# EAGLE design RF_INPUT_DIFF (EAGLE 7.4.0)
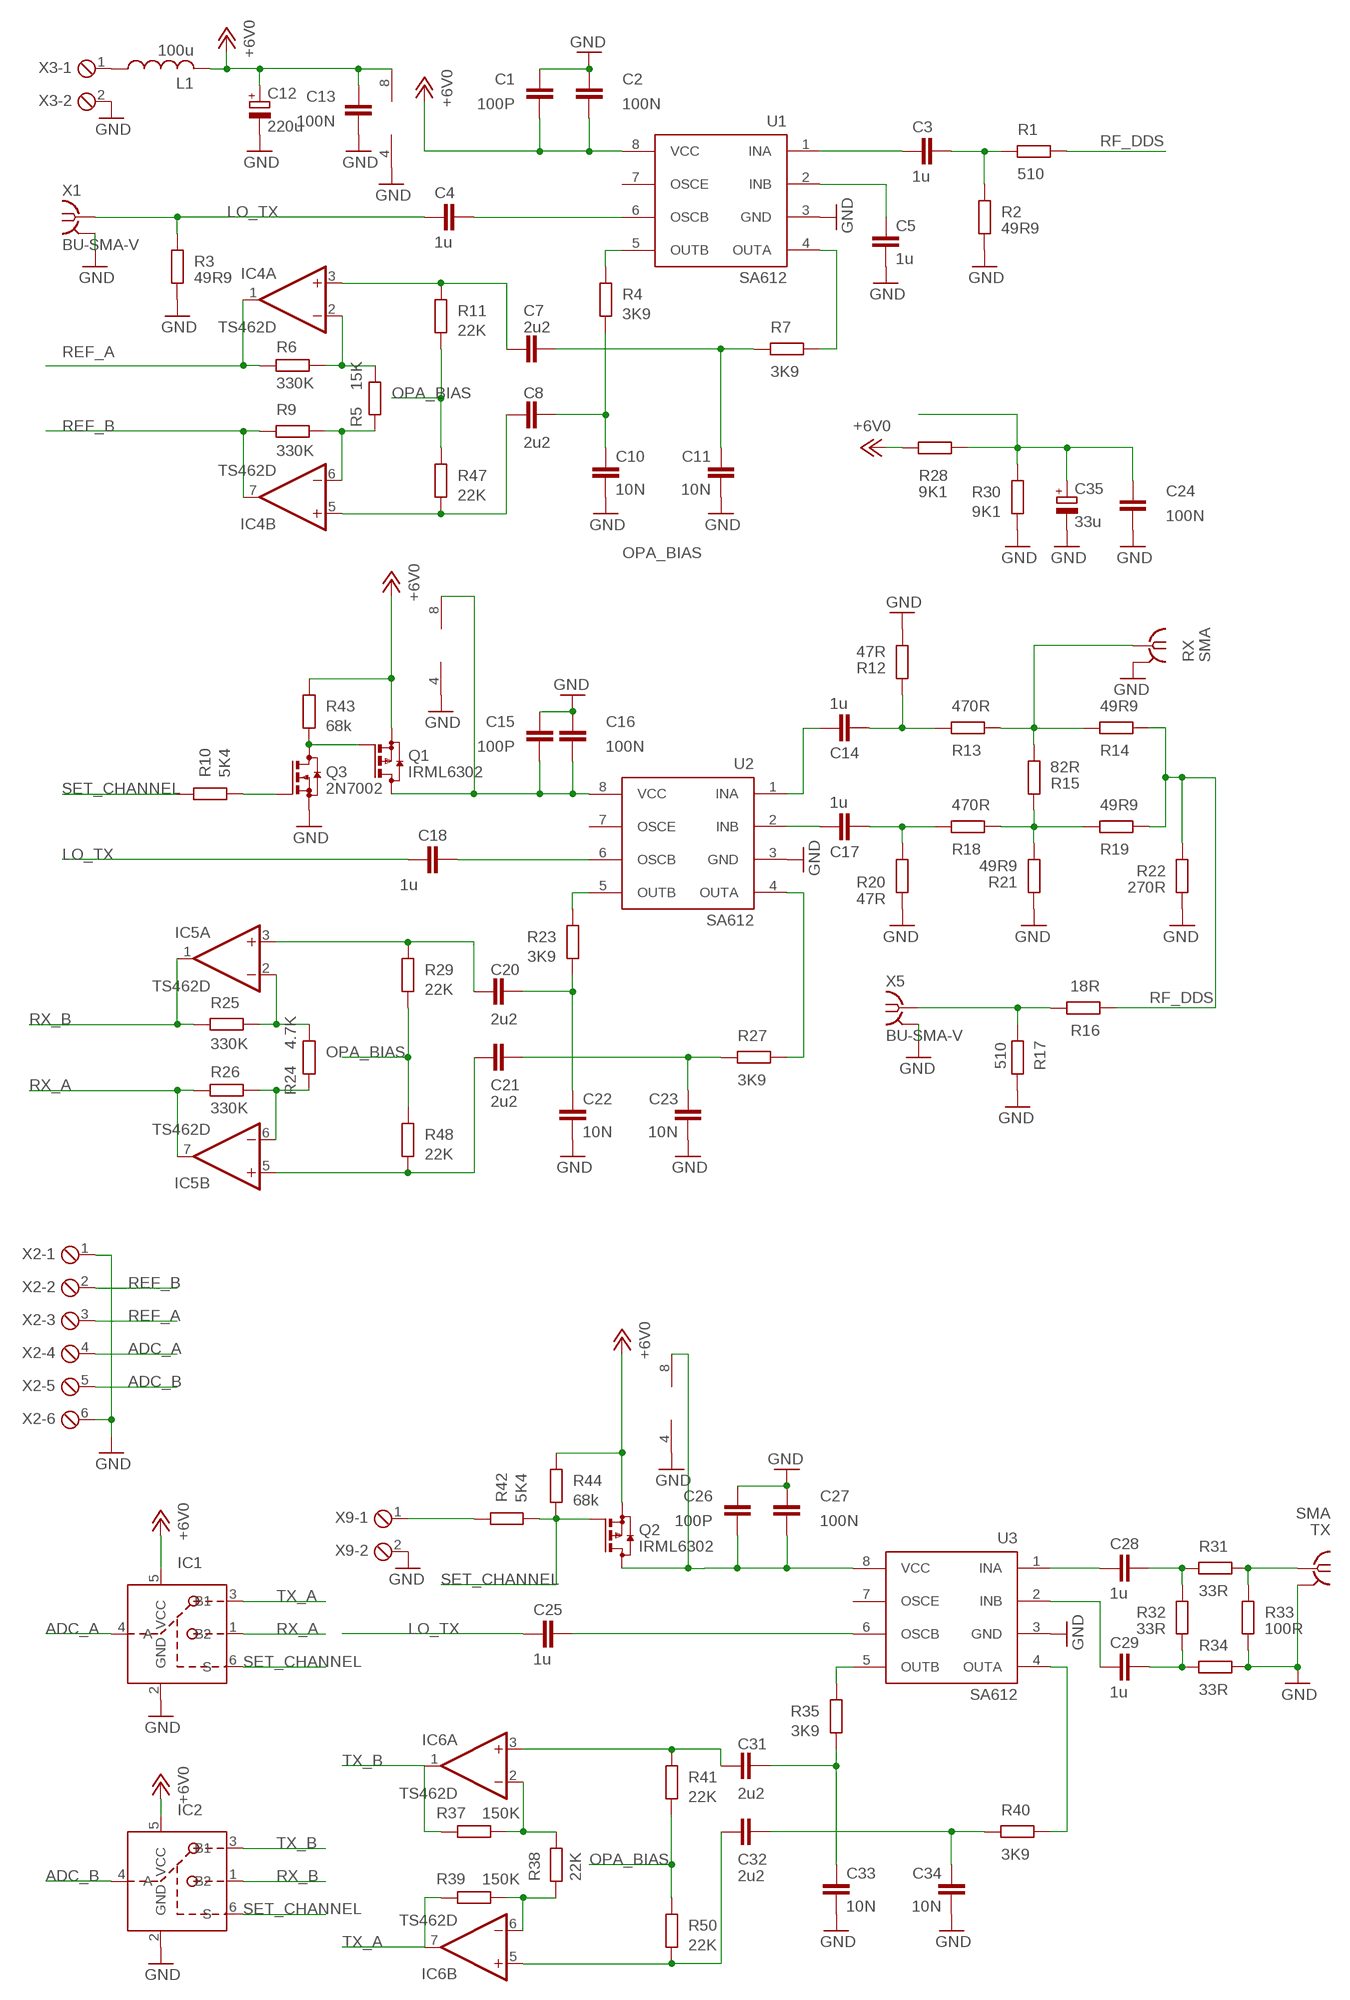
[diagram p0: schematic, sheet 1]

## Parts
C1  100P  C-EUC0805  [C0805]
C2  100N  C-EUC0603  [C0603]
C3  1u  C-EUC0603  [C0603]
C4  1u  C-EUC0805  [C0805]
C5  1u  C-EUC0603  [C0603]
C7  2u2  C-EUC0805  [C0805]
C8  2u2  C-EUC0805  [C0805]
C10  10N  C-EUC0805  [C0805]
C11  10N  C-EUC0805  [C0805]
C12  220u  CPOL-EU153CLV-0605  [153CLV-0605]
C13  100N  C-EUC0603  [C0603]
C14  1u  C-EUC0603  [C0603]
C15  100P  C-EUC0805  [C0805]
C16  100N  C-EUC0603  [C0603]
C17  1u  C-EUC0603  [C0603]
C18  1u  C-EUC0805  [C0805]
C20  2u2  C-EUC0805  [C0805]
C21  2u2  C-EUC0805  [C0805]
C22  10N  C-EUC0805  [C0805]
C23  10N  C-EUC0805  [C0805]
C24  100N  C-EUC0603  [C0603]
C25  1u  C-EUC0805  [C0805]
C26  100P  C-EUC0805  [C0805]
C27  100N  C-EUC0603  [C0603]
C28  1u  C-EUC0603  [C0603]
C29  1u  C-EUC0603  [C0603]
C31  2u2  C-EUC0805  [C0805]
C32  2u2  C-EUC0805  [C0805]
C33  10N  C-EUC0805  [C0805]
C34  10N  C-EUC0805  [C0805]
C35  33u  CPOL-EU153CLV-0605  [153CLV-0605]
IC1  SN74LVC1G3157DBVR  [SOT23-6]
IC2  SN74LVC1G3157DBVR  [SOT23-6]
IC4  TS462D  LM358D  [SO08]
IC5  TS462D  LM358D  [SO08]
IC6  TS462D  LM358D  [SO08]
L1  100u  L-US0207/12  [0207/12]
Q1  IRML6302  BSS84  [SOT23]
Q2  IRML6302  BSS84  [SOT23]
Q3  2N7002  BSS123  [SOT23]
R1  510  R-EU_R0603  [R0603]
R2  49R9  R-EU_R0805  [R0805]
R3  49R9  R-EU_R0805  [R0805]
R4  3K9  R-EU_R0603  [R0603]
R5  15K  R-EU_R0603  [R0603]
R6  330K  R-EU_R0603  [R0603]
R7  3K9  R-EU_R0603  [R0603]
R9  330K  R-EU_R0603  [R0603]
R10  5K4  R-EU_R0603  [R0603]
R11  22K  R-EU_R0603  [R0603]
R12  47R  R-EU_R0603  [R0603]
R13  470R  R-EU_R0603  [R0603]
R14  49R9  R-EU_R0805  [R0805]
R15  82R  R-EU_R0603  [R0603]
R16  18R  R-EU_R0603  [R0603]
R17  510  R-EU_R0603  [R0603]
R18  470R  R-EU_R0603  [R0603]
R19  49R9  R-EU_R0805  [R0805]
R20  47R  R-EU_R0603  [R0603]
R21  49R9  R-EU_R0805  [R0805]
R22  270R  R-EU_R0603  [R0603]
R23  3K9  R-EU_R0603  [R0603]
R24  4.7K  R-EU_R0603  [R0603]
R25  330K  R-EU_R0603  [R0603]
R26  330K  R-EU_R0603  [R0603]
R27  3K9  R-EU_R0603  [R0603]
R28  9K1  R-EU_R0603  [R0603]
R29  22K  R-EU_R0603  [R0603]
R30  9K1  R-EU_R0603  [R0603]
R31  33R  R-EU_R0603  [R0603]
R32  33R  R-EU_R0603  [R0603]
R33  100R  R-EU_R0603  [R0603]
R34  33R  R-EU_R0603  [R0603]
R35  3K9  R-EU_R0603  [R0603]
R37  150K  R-EU_R0603  [R0603]
R38  22K  R-EU_R0603  [R0603]
R39  150K  R-EU_R0603  [R0603]
R40  3K9  R-EU_R0603  [R0603]
R41  22K  R-EU_R0603  [R0603]
R42  5K4  R-EU_R0603  [R0603]
R43  68k  R-EU_R0603  [R0603]
R44  68k  R-EU_R0603  [R0603]
R47  22K  R-EU_R0603  [R0603]
R48  22K  R-EU_R0603  [R0603]
R50  22K  R-EU_R0603  [R0603]
RX  SMA  SMA-142-0701-801/806  [J502-ND-142-0701-801/806]
TX  SMA  SMA-142-0701-801/806  [J502-ND-142-0701-801/806]
U1  SA612  [SO8]
U2  SA612  [SO8]
U3  SA612  [SO8]
X1  BU-SMA-V  [BU-SMA-V]
X2  MPT6  [6POL254]
X3  MPT2  [2POL254]
X5  BU-SMA-V  [BU-SMA-V]
X9  MPT2  [2POL254]

## Nets
+6V0: C1.1 C2.1 C12.+ C13.1 IC1.5(VCC) IC2.5(VCC) IC4.8(P:V+) L1.2 Q1.2(S) Q2.2(S) R28.2 R43.1 R44.1 U1.8(VCC)
ADC_A: IC1.4(A) X2.4
ADC_B: IC2.4(A) X2.5
GND: C1.2 C2.2 C5.2 C10.2 C11.2 C12.- C13.2 C15.2 C16.2 C22.2 C23.2 C24.1 C26.2 C27.2 C33.2 C34.2 C35.- IC1.2(GND) IC2.2(GND) IC4.4(P:V-) IC5.4(P:V-) IC6.4(P:V-) Q3.2(S) R2.1 R3.2 R12.2 R17.2 R20.1 R21.1 R22.2 R30.2 R33.2 R34.1 RX.G@1 RX.G@2 RX.G@3 RX.G@4 TX.G@1 TX.G@2 TX.G@3 TX.G@4 U1.3(GND) U2.3(GND) U3.3(GND) X1.2 X1.3 X1.4 X1.5 X2.1 X2.6 X3.2 X5.2 X5.3 X5.4 X5.5 X9.2
LO_TX: C4.1 C18.1 C25.1 R3.1 X1.1
N$1: R15.1 R18.1 R19.2 R21.2
N$2: IC6.2(A:-IN) R37.1 R38.1
N$3: C25.2 U3.6(OSCB)
N$4: C26.1 C27.1 IC6.8(P:V+) Q2.3(D) U3.8(VCC)
N$5: R13.1 R14.2 R15.2 RX.1
N$6: Q1.1(G) Q3.3(D) R43.2
N$7: L1.1 X3.1
N$8: C15.1 C16.1 IC5.8(P:V+) Q1.3(D) U2.8(VCC)
N$9: R42.1 X9.1
N$10: IC4.2(A:-IN) R5.1 R6.1
N$11: C31.1 IC6.3(A:+IN) R41.1
N$12: C32.1 IC6.5(B:+IN) R50.2
N$13: IC4.6(B:-IN) R5.2 R9.1
N$14: Q3.1(G) R10.2
N$17: C7.1 IC4.3(A:+IN) R11.1
N$18: C8.1 IC4.5(B:+IN) R47.2
N$19: C20.1 IC5.3(A:+IN) R29.1
N$20: C21.1 IC5.5(B:+IN) R48.2
N$21: IC5.6(B:-IN) R24.2 R26.1
N$22: IC5.2(A:-IN) R24.1 R25.1
N$26: IC6.6(B:-IN) R38.2 R39.1
N$30: R31.1 R33.1 TX.1
N$31: C28.2 R31.2 R32.1
N$32: C29.2 R32.2 R34.2
N$33: C29.1 U3.2(INB)
N$34: C28.1 U3.1(INA)
N$35: C31.2 C33.1 R35.2
N$36: R40.1 U3.4(OUTA)
N$37: C32.2 C34.1 R40.2
N$38: R35.1 U3.5(OUTB)
N$39: C17.1 U2.2(INB)
N$42: C17.2 R18.2 R20.2
N$49: C14.1 U2.1(INA)
N$51: C20.2 C22.1 R23.2
N$52: R27.1 U2.4(OUTA)
N$53: C21.2 C23.1 R27.2
N$54: R23.1 U2.5(OUTB)
N$60: C14.2 R12.1 R13.2
N$61: C18.2 U2.6(OSCB)
N$62: C5.1 U1.2(INB)
N$63: R14.1 R16.2 R19.1 R22.1
N$64: C3.1 U1.1(INA)
N$65: C8.2 C10.1 R4.2
N$66: R7.1 U1.4(OUTA)
N$67: C7.2 C11.1 R7.2
N$68: R4.1 U1.5(OUTB)
N$74: C3.2 R1.2 R2.2
N$76: C4.2 U1.6(OSCB)
OPA_BIAS: C24.2 C35.+ R11.2 R28.1 R29.2 R30.1 R41.2 R47.1 R48.1 R50.1
REF_A: IC4.1(A:OUT) R6.2 X2.3
REF_B: IC4.7(B:OUT) R9.2 X2.2
RF_DDS: R1.1 R16.1 R17.1 X5.1
RX_A: IC1.1(B2) IC5.7(B:OUT) R26.2
RX_B: IC2.1(B2) IC5.1(A:OUT) R25.2
SET_CHANNEL: IC1.6(S) IC2.6(S) Q2.1(G) R10.1 R42.2 R44.2
TX_A: IC1.3(B1) IC6.7(B:OUT) R39.2
TX_B: IC2.3(B1) IC6.1(A:OUT) R37.2
Unconnected: U1.7(OSCE) U2.7(OSCE) U3.7(OSCE)

## Library data of the parts
C1-C5 C7 C8 C10 C11 C13-C18 C20-C29 C31-C34 = rcl:C-EU: CAPACITOR, European symbol
C12 C35 = rcl:CPOL-EU: POLARIZED CAPACITOR, European symbol
IC1 IC2 = balmer:SN74LVC1G3157DBVR: SINGLE-POLE DOUBLE-THROW ANALOG SWITCH
IC4-IC6 = linear:LM358: OP AMP also LM158; LM258; LM2904 Source: http://cache.national.com/ds/LM/LM158.pdf
L1 = rcl:L-US: INDUCTOR, American symbol
Q1 Q2 = transistor-small-signal:BSS84: P-CHANNEL MOS FET
Q3 = transistor-small-signal:BSS123: N-CHANNEL MOS FET
R1-R7 R9-R35 R37-R44 R47 R48 R50 = rcl:R-EU_: RESISTOR, European symbol
RX TX = con-coax:SMA-: SMA 50 Ohm End Launch Jack Receptacle - Round Contact Johnson Components Source: www.johnsoncomponents.com .. J502-ND.pdf; MF: JOHNSON COMPONENTS; MPN: 142-0701-801; OC_FARNELL: 1608592; OC_NEWARK: 90F2624
U1-U3 = vnwa:SA612
X1 X5 = con-coax:BU-SMA-V: FEMALE SMA CONNECTOR Radiall distributor RS 112-3794; OC_FARNELL: unknown; OC_NEWARK: unknown
X2 = con-phoenix-254:MPT6: PHOENIX CONNECTOR; OC_FARNELL: unknown; OC_NEWARK: unknown
X3 X9 = con-phoenix-254:MPT2: PHOENIX CONNECTOR; OC_FARNELL: unknown; OC_NEWARK: unknown

## Board
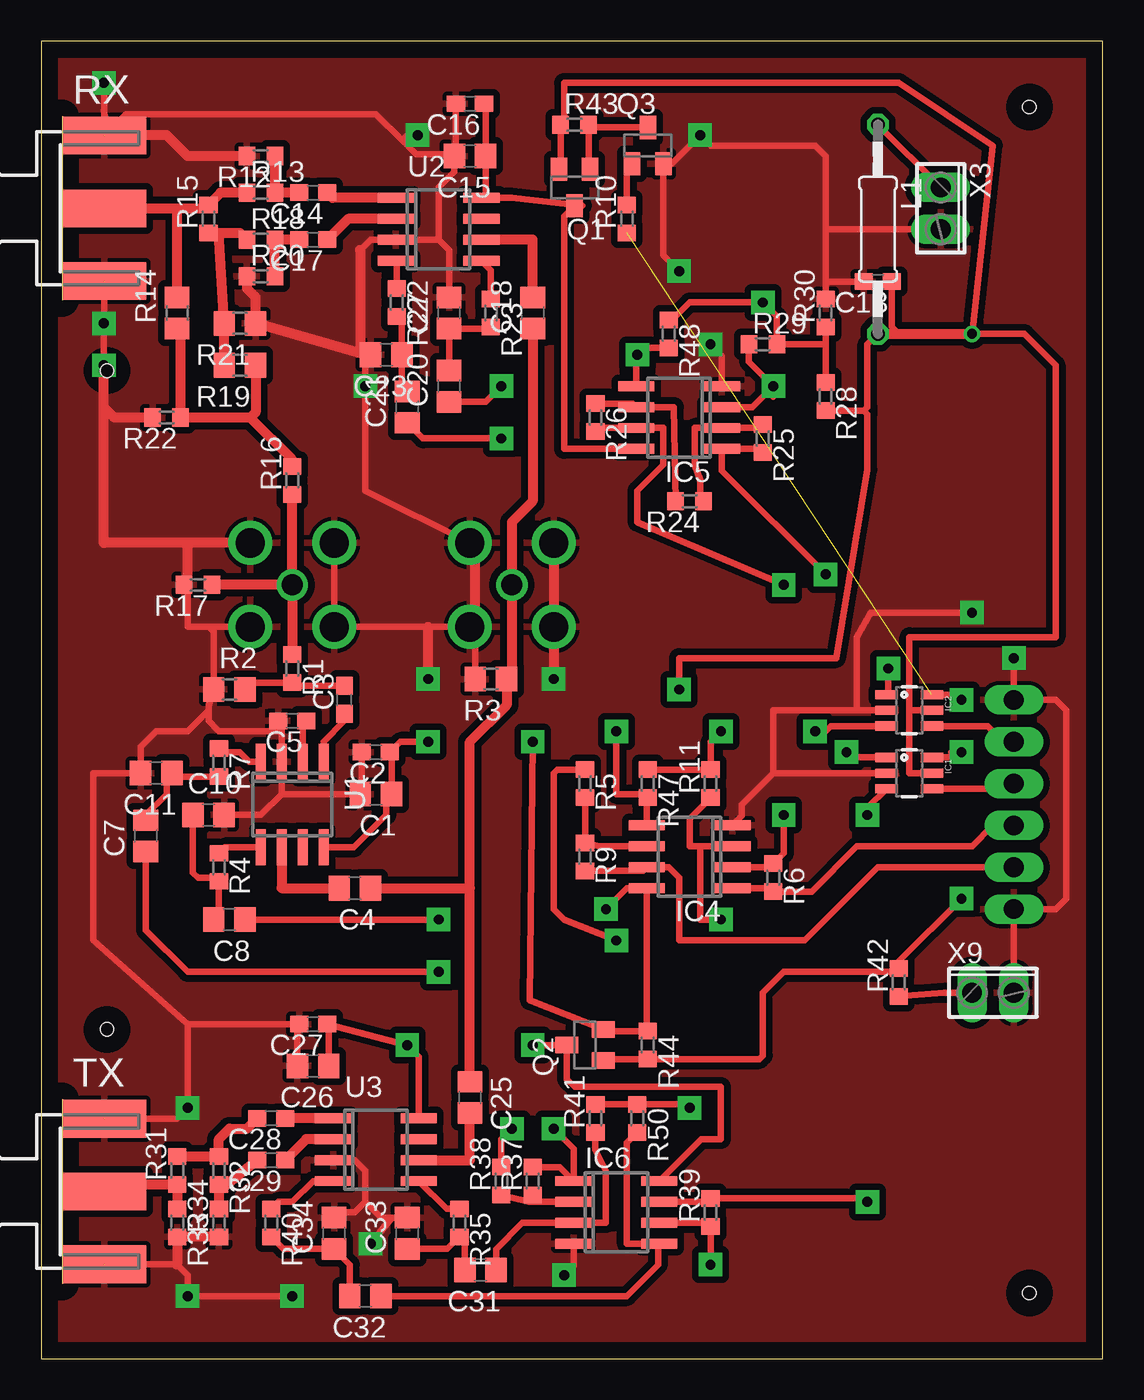
[diagram p1: board, top side]
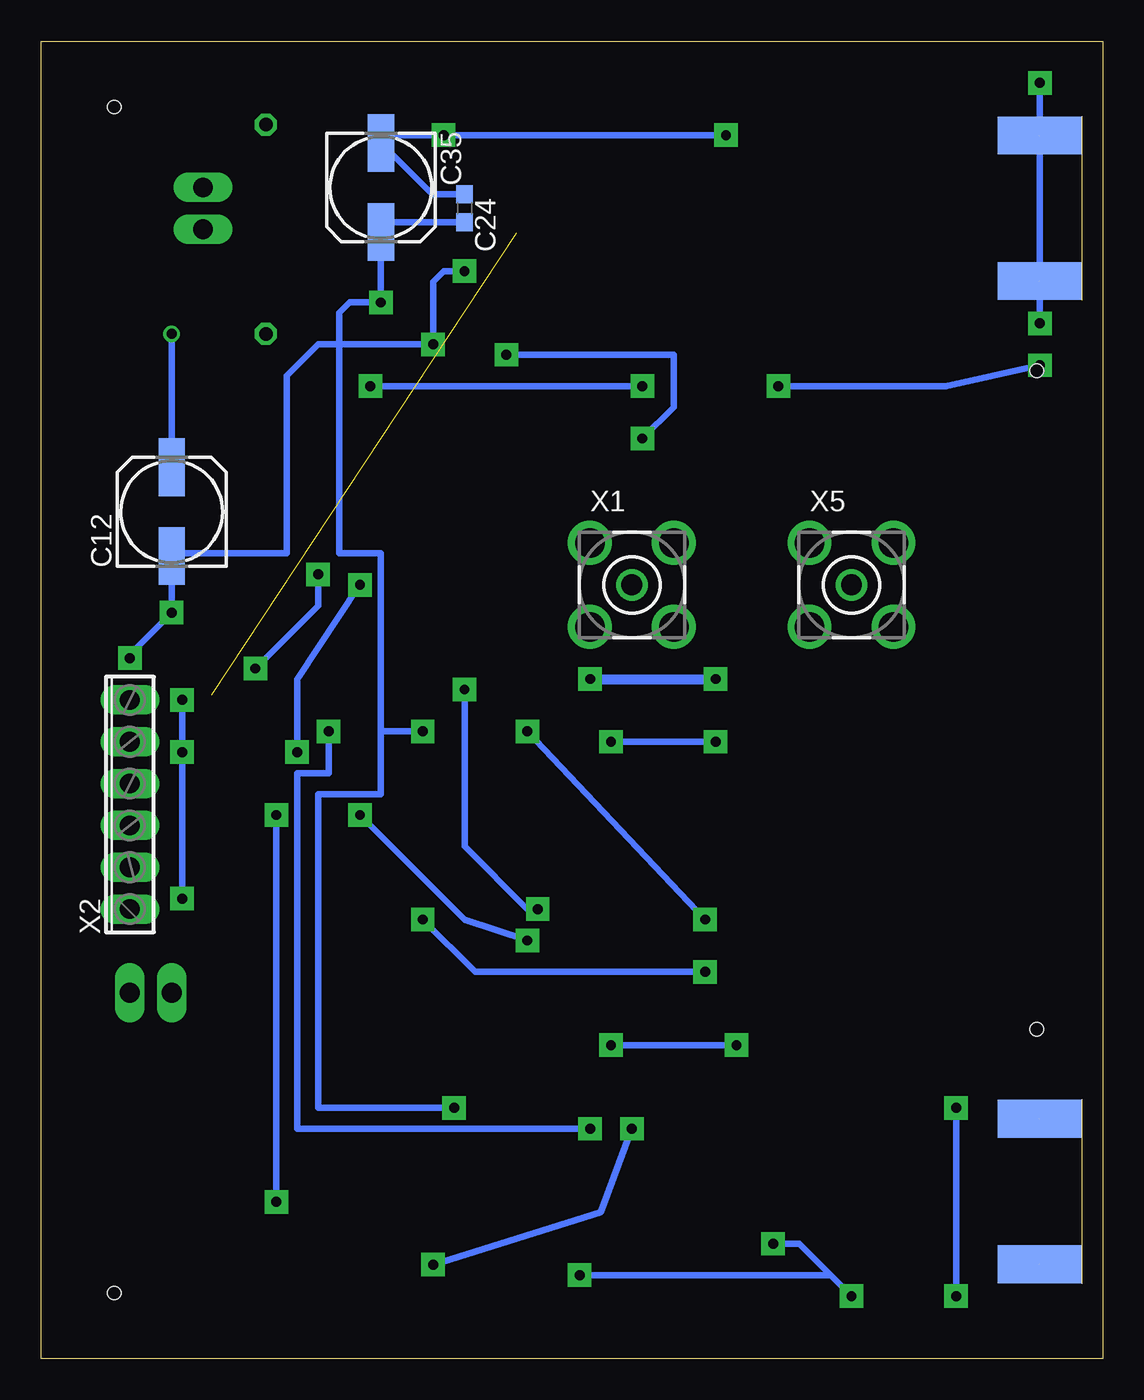
[diagram p2: board, bottom side, seen from below]

Size 64.44 x 80 mm. Coordinates in mm from the lower left corner, seen from the top.
Outline: 0,0 64.44,0 64.44,80 0,80 0,0
Copper layers (1*16): Top 0.035mm / dielectric 1.5mm / Bottom 0.035mm
Design rules "default": minimum track width 10mil, minimum drill 24mil, track to track 8mil, track to pad 8mil, pad to pad 8mil, via to via 8mil, smd to smd 8mil, copper to edge 40mil, drill to drill 8mil, minimum pad ring 10mil, minimum via ring 8mil, stop-mask expansion 4mil, vias tented up to drill 0mil, thermal gap 10mil
Holes 0.8 mm at 4,20 4,60 60,4 60,76

### Footprints (pad centres in the part's own frame; a part is rotated, then mirrored left to right if it is on the bottom)
C0805 = smd 1.3 x 1.5: 1 -0.95,0; 2 0.95,0
C0603 = smd 1.1 x 1: 1 -0.85,0; 2 0.85,0
153CLV-0605 = smd 3.5 x 1.6: + 2.7,0; - -2.7,0
SOT23-6 = smd 0.55 x 1.35: 1 -0.95,-1.375; 2 0,-1.375; 3 0.95,-1.375; 4 0.95,1.375; 5 0,1.375; 6 -0.95,1.375
SO08 = smd 0.6 x 2.2: 1 -1.905,-2.6; 2 -0.635,-2.6; 3 0.635,-2.6; 4 1.905,-2.6; 5 1.905,2.6; 6 0.635,2.6; 7 -0.635,2.6; 8 -1.905,2.6
0207/12 = drill 0.813 octagon: 1 -6.35,0; 2 6.35,0
SOT23 = smd 1 x 1.4: 1 -0.95,-1.1; 2 0.95,-1.1; 3 0,1.1
R0603 = smd 1 x 1.1: 1 -0.85,0; 2 0.85,0
R0805 = smd 1.3 x 1.5: 1 -0.95,0; 2 0.95,0
J502-ND-142-0701-801/806 = smd 5.08 x 2.286: 1 2.565,0; G@1 2.565,4.42; G@2 2.565,-4.42 | smd 5.08 x 2.286 bottom: G@3 2.565,4.42; G@4 2.565,-4.42
SO8 = smd 0.6 x 2.2: 1 -1.905,-2.6; 2 -0.635,-2.6; 3 0.635,-2.6; 4 1.905,-2.6; 5 1.905,2.6; 6 0.635,2.6; 7 -0.635,2.6; 8 -1.905,2.6
BU-SMA-V = drill 1.27: 1 0,0 | drill 1.778: 2 -2.55,2.55; 3 2.55,2.55; 4 2.55,-2.55; 5 -2.55,-2.55
6POL254 = drill 1.2 pad 1.778 long: 1 -6.35,0; 2 -3.81,0; 3 -1.27,0; 4 1.27,0; 5 3.81,0; 6 6.35,0
2POL254 = drill 1.2 long: 1 -1.27,0; 2 1.27,0

### Placement (x,y rotation side)
C1  20.32,34.29 180 top
C2  20.32,36.83 180 top
C3  18.41,40.01 90 top
C4  19.05,28.57 180 top
C5  15.24,38.73 180 top
C7  6.35,31.75 90 top
C8  11.43,26.67 180 top
C10  10.16,33.02 0 top
C11  6.99,35.56 180 top
C12  56.52,51.44 90 bottom
C13  50.8,65.41 180 top
C14  16.51,70.8 180 top
C15  26.04,73.03 180 top
C16  26.04,76.2 180 top
C17  16.51,67.94 180 top
C18  29.84,63.5 90 top
C20  24.77,59.05 90 top
C21  22.23,57.78 90 top
C22  24.77,63.5 90 top
C23  20.95,60.96 180 top
C24  38.73,69.85 270 bottom
C25  26.04,15.88 270 top
C26  16.51,17.78 180 top
C27  16.51,20.32 180 top
C28  13.97,14.61 180 top
C29  13.97,12.06 180 top
C31  26.67,5.4 180 top
C32  19.68,3.81 180 top
C33  22.23,7.62 90 top
C34  17.78,7.62 90 top
C35  43.81,71.12 270 bottom
IC1  52.7,35.56 270 top
IC2  52.7,39.37 270 top
IC4  39.37,30.48 90 top
IC5  38.73,57.15 90 top
IC6  34.92,8.89 270 top
L1  50.8,68.58 270 top
Q1  32.38,71.12 180 top
Q2  33.02,19.05 90 top
Q3  36.83,73.66 0 top
R1  15.24,41.91 270 top
R2  11.43,40.64 0 top
R3  27.3,41.27 180 top
R4  10.79,29.84 270 top
R5  33.02,34.92 270 top
R6  44.45,29.21 270 top
R7  10.79,36.2 270 top
R9  33.02,30.48 270 top
R10  35.56,69.22 90 top
R11  40.64,34.92 90 top
R12  13.34,73.03 180 top
R13  13.34,70.8 0 top
R14  8.26,63.5 90 top
R15  10.16,69.22 90 top
R16  15.24,53.34 90 top
R17  9.53,46.99 180 top
R18  13.34,67.94 0 top
R19  12.06,60.33 180 top
R20  13.34,65.72 0 top
R21  12.06,62.87 180 top
R22  7.62,57.15 180 top
R23  27.3,63.5 270 top
R24  39.37,52.07 180 top
R25  43.81,55.88 270 top
R26  33.66,57.15 270 top
R27  21.59,64.14 270 top
R28  47.62,58.42 270 top
R29  43.81,61.59 0 top
R30  47.62,63.5 90 top
R31  8.26,11.43 90 top
R32  10.79,11.43 270 top
R33  8.26,8.26 270 top
R34  10.79,8.26 90 top
R35  25.4,8.26 270 top
R37  29.84,10.79 90 top
R38  27.94,10.79 90 top
R39  40.64,8.89 90 top
R40  13.97,8.26 270 top
R41  33.66,14.61 90 top
R42  52.07,22.86 90 top
R43  32.38,74.93 0 top
R44  36.83,19.05 270 top
R47  36.83,34.92 270 top
R48  38.1,62.23 270 top
R50  36.2,14.61 270 top
RX  1.27,69.85 0 top
TX  1.27,10.16 0 top
U1  15.24,33.66 180 top
U2  24.13,68.58 270 top
U3  20.32,12.7 270 top
X1  28.57,46.99 0 bottom
X2  59.05,33.66 90 bottom
X3  54.61,69.85 270 top
X5  15.24,46.99 0 bottom
X9  57.78,22.23 0 top

### Tracks (layer width: path | path; a pad name or v marks a point on that pad's centre or on a via)
+6V0  (via drill 0.6, 0.6 pad 1.42)
  Top 0.406: Q1.2 31.54,72.32 R43.1 31.75,75.14 31.75,77.47 52.07,77.47 57.78,73.66 v56.52,62.23 59.69,62.23 61.59,60.33 61.59,43.81 52.7,43.81 52.7,39.37 | U1.8 18.99,31.05 20.95,33.02 20.95,33.98 C1.1 21.27,36.73 C2.1 21.8,37.47 v23.5,37.47 | v29.84,37.47 29.68,21.76 Q2.2 34.22,19.9 R44.1 36.77,19.96 IC4.8 35.56,28.57 v34.29,27.3 | IC1.5 52.7,35.56 52.7,39.37 | 52.7,39.37 IC2.5 | C13.1 51.65,62.65 52.07,62.23 | R28.2 49.95,57.57 | 49.95,57.57 50.16,57.78 50.16,61.59 L1.2 | v38.73,40.64 38.73,42.55 48.26,42.55 50.16,53.98 50.16,57.35 49.95,57.57
  Top 0.61: L1.2 52.07,62.23 v56.52,62.23
  Bottom 0.406: v29.84,37.47 v23.5,37.47 | C12.+ v56.52,62.23 | v34.29,27.3 34.92,27.3 38.73,31.11 v38.73,40.64
ADC_A
  Top 0.406: IC1.4 58.74,34.61 X2.4
ADC_B
  Top 0.406: IC2.4 57.47,38.42 58.42,37.47 X2.5
GND  (via drill 0.6 pad 1.42)  (4 unrouted)
  Top 0.406: R17.2 8.89,46.99 8.89,44.45 10.16,44.45 | 10.16,44.45 X5.4 | 3.81,75.78 4.08,74.51 RX.G@3 | v3.81,60.33 3.83,64.75 RX.G@4 3.83,63.52 v3.81,62.87 | C22.2 24.77,67.31 24.13,67.94 | 24.13,67.94 U2.3 20,67.94 19.37,67.31 | TX.G@4 8.23,5.74 8.89,5.08 v8.89,3.81 v15.24,3.81 | C16.2 25.18,73.12 | 25.18,73.12 C15.2 25.09,72.08 24.13,71.12 24.13,67.94 | TX.G@3 8.23,14.58 v8.89,15.24 8.89,20.32 | X5.2 X5.5 23.5,44.44 X1.4 26.36,44.11 R3.2 | 10.16,44.45 10.48,44.13 R2.1 10.16,39.69 10.16,39.37 | 14.61,38.1 U1.3 14.61,34.29 | 14.61,38.1 10.79,38.1 10.16,38.73 10.16,39.37 | C5.2 14.39,38.31 14.61,38.1 | C10.2 13.34,33.02 14.61,34.29 | C2.2 19.47,34.39 C1.2 14.61,34.29 | 10.16,39.37 8.89,38.1 6.99,38.1 6.04,37.15 C11.2 3.17,35.56 3.17,25.4 8.89,20.32 | X1.3 19.68,52.72 v19.68,59.05 19.68,60.96 C23.2 | 8.89,20.32 C27.2 15.56,20.22 C26.2 | U3.3 19.05,12.06 19.68,11.43 19.68,9.53 | 19.68,9.53 19.05,8.89 18.1,8.89 C34.2 | 19.68,9.53 20.64,8.57 C33.2 21.27,8.57 v20,6.99 | IC6.4 32.33,5.66 v31.75,5.08 | X9.2 X2.1 61.59,27.3 62.23,27.94 62.23,39.37 61.59,40.01 X2.6 v59.05,42.55 | R30.2 47.62,65.41 | 47.62,65.41 47.62,68.58 | 47.62,68.58 47.62,73.03 46.99,73.66 40.64,73.66 v40.01,74.3 38.27,72.56 Q3.2 37.78,67 v38.73,66.04 | X3.2 47.62,68.58 | C13.2 47.62,65.41 | IC5.4 41.34,60.9 v40.64,61.59 | IC1.2 44.45,35.56 | 44.45,35.56 42.55,33.66 42.55,32.96 IC4.4 | IC2.2 49.53,39.37 | 49.53,39.37 44.45,39.37 44.45,35.56 | v56.52,45.3 50.38,45.3 49.53,43.81 49.53,39.37 | RX.G@3 3.83,77.44 v3.81,77.47 | 25.18,73.12 22.76,73.12 21.91,73.98 | 21.91,73.98 20.32,75.56 5.13,75.56 RX.G@3 | v22.86,74.3 22.23,74.3 21.91,73.98
  Top 0.61: 26.36,44.11 26.36,49.21 X1.3 | 19.37,67.31 19.37,61.28 19.68,60.96 R21.1 13.02,64.45 12.48,64.98 R20.1 | v31.11,41.27 31.12,41.28 X1.5 X1.2 | v23.5,41.27 23.5,44.44 | R22.2 4.45,57.15 3.81,57.78 | 3.81,57.78 v3.81,60.33 | X5.3 8.89,49.54 | 8.89,49.54 3.82,49.54 3.81,49.53 3.81,57.78 | 8.89,46.99 8.89,49.54 | 8.23,5.74 8.26,5.77 R33.2 R34.1 | R12.2 8.89,73.03 7.62,74.3 3.86,74.3 RX.G@3
  Bottom 0.406: v19.68,59.05 9.53,59.05 v3.81,60.33 | v8.89,15.24 v8.89,3.81 | v3.81,62.87 v3.81,77.47 | v20,6.99 18.41,6.99 16.51,5.08 | 16.51,5.08 v15.24,3.81 | v31.75,5.08 16.51,5.08 | C24.1 40.7,70.7 C35.- 43.34,74.3 v40.01,74.3 v22.86,74.3 | v59.05,42.55 59.05,42.76 v56.52,45.3 C12.- 56.35,48.9 49.53,48.9 49.53,59.69 47.62,61.59 v40.64,61.59 40.64,65.41 40.01,66.04 v38.73,66.04
  Bottom 0.61: v31.11,41.27 v23.5,41.27
  pour Top (isolate 0.406): 0,80.01 64.14,80.01 64.14,0 0,0
LO_TX
  Top 0.61: C18.1 29.84,52.07 28.57,50.8 X1.1 28.57,41.59 R3.1 28.25,39.69 26.04,37.47 26.04,28.57 | C25.1 26.04,28.57 | C4.1 26.04,28.57
N$1
  Top 0.61: R15.1 10.79,68.36 | 10.79,68.36 12.06,68.36 R18.1 | 10.79,68.36 R21.2 R19.2
N$2
  Top 0.406: IC6.2 29.84,9.53 | 29.84,9.53 29.63,9.53 R38.1 | R37.1 29.84,9.53
N$3
  Top 0.61: U3.6 26.04,12.06 C25.2
N$4  (via drill 0.6 pad 1.42)
  Top 0.406: v29.84,19.05 Q2.3 31.92,16.98 32.38,16.51 41.27,16.51 41.27,13.34 40.06,13.34 IC6.8 | C26.1 17.46,20.22 C27.1 v22.23,19.05 22.92,18.36 U3.8
  Bottom 0.406: v29.84,19.05 v22.23,19.05
N$5
  Top 0.61: RX.1 8.26,69.85 | 8.26,69.85 9.95,69.85 R15.2 10.9,70.8 R13.1 | R14.2 8.26,69.85
N$6
  Top 0.406: Q1.1 33.23,72.32 R43.2 33.23,74.76 Q3.3
N$7
  Top 0.406: X3.1 L1.1
N$8
  Top 0.406: C16.1 26.98,76.1 C15.1 26.98,70.74 U2.8 28.57,70.48 32.85,70.02 Q1.3 31.75,69.39 31.75,55.24 IC5.8
N$9
  Top 0.406: X9.1 54.83,22.23 R42.1
N$10  (via drill 0.6 pad 1.42)
  Top 0.406: IC4.2 44.23,29.84 R6.1 45.09,30.7 v45.09,33.02 | R5.1 31.33,35.77 31.11,35.56 31.11,27.3 31.75,26.67 v34.92,25.4
  Bottom 0.406: v34.92,25.4 38.73,26.67 v45.09,33.02
N$11
  Top 0.406: C31.1 27.62,6.67 29.21,8.26 IC6.3 34.29,8.26 34.29,11.43 33.66,12.7 R41.1
N$12
  Top 0.406: C32.1 35.56,3.81 37.47,5.71 37.47,6.92 IC6.5 35.56,6.99 35.56,13.12 R50.2
N$13
  Top 0.406: IC4.6 33.87,31.11 R9.1 R5.2
N$14
  Top 0.406: Q3.1 35.56,72.56 R10.2
N$17  (via drill 0.6 pad 1.42)
  Top 0.406: IC4.3 40.01,31.11 | 40.01,31.11 39.37,31.11 39.37,32.8 R11.1 | C7.1 6.35,26.04 8.89,23.5 v24.13,23.5 | v41.27,26.67 40.01,26.67 40.01,31.11
  Bottom 0.406: v24.13,23.5 38.1,23.5 v41.27,26.67
N$18  (via drill 0.6 pad 1.42)
  Top 0.406: IC4.5 36.77,34.02 R47.2 36.62,34.29 34.92,34.29 v34.92,38.1 | C8.1 v24.13,26.67
  Bottom 0.406: v24.13,26.67 v34.92,38.1
N$19  (via drill 0.6 pad 1.42)
  Top 0.406: C20.1 26.99,58.1 v27.94,59.05 | v44.45,59.05 44.45,58.42 | IC5.3 43.18,57.78 v44.45,59.05 | R29.1 42.97,60.54 v44.45,59.05
  Bottom 0.406: v27.94,59.05 v44.45,59.05
N$20  (via drill 0.6 pad 1.42)
  Top 0.406: IC5.5 36.13,60.9 v36.2,60.96 36.62,61.38 R48.2 | v27.94,55.88 23.18,55.88 C21.1
  Bottom 0.406: v36.2,60.96 26.04,60.96 26.04,57.78 v27.94,55.88
N$21
  Top 0.406: R26.1 35.92,58 IC5.6 38.42,57.78 R24.2
N$22
  Top 0.406: R25.1 43.6,56.52 IC5.2 39.69,56.52 39.69,54.29 40.01,53.34 40.01,52.28 R24.1
N$26  (via drill 0.6 pad 1.42)
  Top 0.406: IC6.6 40.42,8.26 R39.1 v40.64,5.71 | R38.2 27.94,13.34 v28.57,13.97
  Bottom 0.406: v28.57,13.97 30.48,8.89 v40.64,5.71
N$30
  Top 0.406: 4.05,10.38 TX.1
  Top 0.61: TX.1 4.25,10.58 R31.1 R33.1
N$31
  Top 0.61: R31.2 R32.1 10.79,13.34 11.43,13.97 12.48,13.97 C28.2
N$32
  Top 0.61: C29.2 10.79,10.16 | 10.79,10.16 R34.2 | R32.2 10.79,10.16
N$33
  Top 0.61: U3.2 16.09,13.34 C29.1
N$34
  Top 0.61: U3.1 C28.1
N$35
  Top 0.406: C33.1 24.66,6.67 R35.2 25.72,7.08 C31.2
N$36
  Top 0.406: U3.4 16.51,10.79 15.24,9.53 14.39,9.53 R40.1
N$37
  Top 0.406: R40.2 14.71,6.67 C34.1 18.73,5.71 C32.2
N$38
  Top 0.406: R35.1 24.61,9.11 U3.5
N$39
  Top 0.61: U2.2 18.63,69.22 C17.1
N$42
  Top 0.61: C17.2 R18.2 R20.2
N$49
  Top 0.61: U2.1 17.68,70.48 C14.1
N$51
  Top 0.406: R23.2 27.2,62.55 C22.1 C20.2
  Top 0.61: 24.45,62.23 C22.1
N$52
  Top 0.406: R27.1 21.59,66.61 U2.4
N$53
  Top 0.406: R27.2 21.91,62.97 C23.1 21.91,59.05 C21.2
N$54
  Top 0.406: R23.1 27.3,66.1 U2.5
N$60
  Top 0.61: C14.2 R13.2 R12.1
N$61
  Top 0.61: C18.2 29.84,67.94 U2.6
N$62
  Top 0.406: U1.2 15.88,38.52 C5.1
N$63
  Top 0.61: R14.1 8.47,62.34 R22.1 12.7,57.15 | R19.1 13.02,57.47 12.7,57.15 | R16.2 15.24,54.61 12.7,57.15
N$64
  Top 0.406: U1.1 17.14,37.47 18.41,38.73 C3.1
N$65
  Top 0.406: C10.1 9.21,29.52 9.53,29.21 10.58,29.21 R4.2 10.79,26.98 C8.2
N$66
  Top 0.406: U1.4 12.64,36.26 12.06,36.83 11.01,36.83 R7.1
N$67
  Top 0.406: C7.2 6.35,33.02 7.62,34.29 7.62,35.24 C11.1 8.15,35.34 R7.2
N$68
  Top 0.406: U1.5 11.15,31.05 R4.1
N$74
  Top 0.406: R2.2 12.8,41.06 R1.2 15.45,40.85 C3.2
N$76
  Top 0.61: U1.6 14.61,28.57 C4.2
OPA_BIAS  (via drill 0.6 pad 1.42)
  Top 0.406: R41.2 R50.1 39.16,15.46 v39.37,15.24 | R30.1 47.62,61.59 | 47.62,61.59 R28.1 | 47.62,61.59 R29.2 44.66,63.28 v43.81,64.14 39.37,64.14 38.31,63.08 R48.1 | R47.1 R11.2 40.64,37.47 v41.27,38.1
  Bottom 0.406: C24.2 43.23,69 C35.+ v43.81,64.14 45.72,64.14 46.35,63.5 46.35,48.9 43.81,48.9 43.81,38.1 | v39.37,15.24 47.62,15.24 47.62,34.29 43.81,34.29 43.81,38.1 | v41.27,38.1 43.81,38.1
REF_A
  Top 0.406: IC4.1 44.23,28.57 R6.2 46.77,28.36 49.53,31.11 56.52,31.11 57.78,32.38 X2.3
REF_B
  Top 0.406: R9.2 36.55,29.63 IC4.7 38.1,29.84 38.73,29.21 38.73,25.4 46.35,25.4 50.8,29.84 X2.2
RF_DDS
  Top 0.61: X5.1 R17.1 | X5.1 R16.1 | X5.1 R1.1
RX_A  (via drill 0.6 pad 1.42)
  Top 0.406: R26.2 33.87,56.52 IC5.7 37.78,56.52 37.78,54.29 36.2,52.7 36.2,50.8 v45.09,46.99 | IC1.1 49.22,36.51 v48.9,36.83
  Bottom 0.406: v48.9,36.83 48.9,41.27 v45.09,46.99
RX_B  (via drill 0.6 pad 1.42)
  Top 0.406: R25.2 43.6,55.24 IC5.1 41.34,53.91 v47.62,47.62 | v51.44,41.91 51.44,40.42 IC2.1
  Bottom 0.406: v47.62,47.62 47.62,45.72 v51.44,41.91
SET_CHANNEL  (via drill 0.6 pad 1.42)  (1 unrouted)
  Top 0.406: Q2.1 34.22,18.2 R44.2 43.6,18.2 43.81,18.41 43.81,22.23 45.09,23.5 51.85,23.5 R42.2 52.07,24.13 v55.88,27.94 | 55.24,36.83 v55.88,36.83 55.56,36.51 IC1.6 | IC2.6 55.56,40.32 v55.88,40.01
  Bottom 0.406: v55.88,27.94 v55.88,36.83 v55.88,40.01
TX_A  (via drill 0.6 pad 1.42)
  Top 0.406: IC6.7 40.42,9.53 R39.2 49.95,9.74 v50.16,9.53 | v50.16,33.02 50.16,33.45 IC1.3
  Bottom 0.406: v50.16,9.53 v50.16,33.02
TX_B  (via drill 0.6 pad 1.42)
  Top 0.406: R37.2 31.48,11.64 IC6.1 32.33,12.76 v31.11,13.97 | v46.99,38.1 47.62,38.1 47.95,38.42 IC2.3
  Bottom 0.406: v31.11,13.97 48.9,13.97 48.9,35.56 46.99,35.56 v46.99,38.1